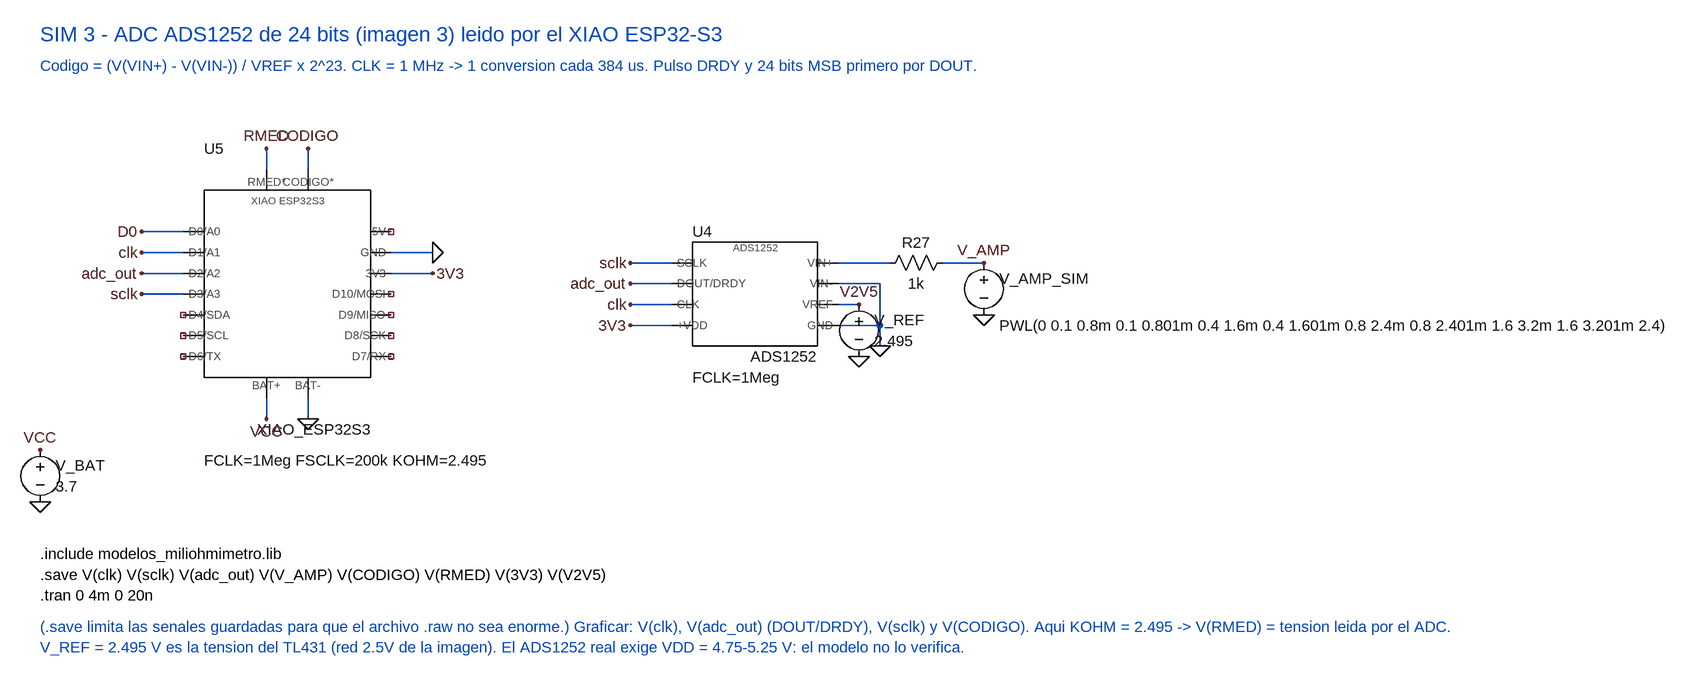
[diagram p0: schematic Sim3_ADS1252.asc]
Sim3_ADS1252.asc, the LTspice schematic file:
Version 4
SHEET 1 2400 1800
WIRE 128 -48 208 -48
WIRE 288 -48 352 -48
WIRE 128 -16 192 -16
WIRE 192 -16 192 48
WIRE 128 48 192 48
WIRE 192 48 192 80
WIRE 128 16 160 16
WIRE -128 -48 -192 -48
WIRE -128 -16 -192 -16
WIRE -128 16 -192 16
WIRE -128 48 -192 48
WIRE -880 -96 -944 -96
WIRE -880 -64 -944 -64
WIRE -880 -32 -944 -32
WIRE -880 0 -944 0
WIRE -560 -64 -496 -64
WIRE -560 -32 -496 -32
WIRE -752 160 -752 192
WIRE -688 160 -688 192
WIRE -752 -192 -752 -224
WIRE -688 -192 -688 -224
FLAG 352 -48 V_AMP
FLAG 192 80 0
FLAG 160 16 V2V5
FLAG -192 -48 sclk
FLAG -192 -16 adc_out
FLAG -192 16 clk
FLAG -192 48 3V3
FLAG 352 32 0
FLAG 160 96 0
FLAG -944 -96 D0
FLAG -944 -64 clk
FLAG -944 -32 adc_out
FLAG -944 0 sclk
FLAG -496 -64 0
FLAG -496 -32 3V3
FLAG -752 192 VCC
FLAG -688 192 0
FLAG -752 -224 RMED
FLAG -688 -224 CODIGO
FLAG -1100 240 VCC
FLAG -1100 320 0
SYMBOL ADS1252 0 0 R0
WINDOW 0 -96 -96 Left 2
WINDOW 3 96 96 Right 2
WINDOW 39 -96 128 Left 2
SYMATTR InstName U4
SYMATTR Value ADS1252
SYMATTR SpiceLine FCLK=1Meg
SYMBOL res 304 -64 R90
WINDOW 0 0 56 VBottom 2
WINDOW 3 32 56 VTop 2
SYMATTR InstName R27
SYMATTR Value 1k
SYMBOL voltage 352 -64 R0
WINDOW 0 24 40 Left 2
WINDOW 3 24 112 Left 2
SYMATTR InstName V_AMP_SIM
SYMATTR Value PWL(0 0.1 0.8m 0.1 0.801m 0.4 1.6m 0.4 1.601m 0.8 2.4m 0.8 2.401m 1.6 3.2m 1.6 3.201m 2.4)
SYMBOL voltage 160 0 R0
WINDOW 0 24 40 Left 2
WINDOW 3 24 72 Left 2
SYMATTR InstName V_REF
SYMATTR Value 2.495
SYMBOL XIAO_ESP32S3 -720 0 R0
WINDOW 0 -128 -224 Left 2
WINDOW 3 128 208 Right 2
WINDOW 39 -128 256 Left 2
SYMATTR InstName U5
SYMATTR Value XIAO_ESP32S3
SYMATTR SpiceLine FCLK=1Meg FSCLK=200k KOHM=2.495
SYMBOL voltage -1100 224 R0
WINDOW 0 24 40 Left 2
WINDOW 3 24 72 Left 2
SYMATTR InstName V_BAT
SYMATTR Value 3.7
TEXT -1100 -400 Left 3 ;SIM 3 - ADC ADS1252 de 24 bits (imagen 3) leido por el XIAO ESP32-S3
TEXT -1100 -352 Left 2 ;Codigo = (V(VIN+) - V(VIN-)) / VREF x 2^23. CLK = 1 MHz -> 1 conversion cada 384 us. Pulso DRDY y 24 bits MSB primero por DOUT.
TEXT -1100 400 Left 2 !.include modelos_miliohmimetro.lib
TEXT -1100 432 Left 2 !.save V(clk) V(sclk) V(adc_out) V(V_AMP) V(CODIGO) V(RMED) V(3V3) V(V2V5)
TEXT -1100 464 Left 2 !.tran 0 4m 0 20n
TEXT -1100 512 Left 2 ;(.save limita las senales guardadas para que el archivo .raw no sea enorme.) Graficar: V(clk), V(adc_out) (DOUT/DRDY), V(sclk) y V(CODIGO). Aqui KOHM = 2.495 -> V(RMED) = tension leida por el ADC.
TEXT -1100 544 Left 2 ;V_REF = 2.495 V es la tension del TL431 (red 2.5V de la imagen). El ADS1252 real exige VDD = 4.75-5.25 V: el modelo no lo verifica.

The netlist it stands for:
* Sim3_ADS1252.asc
XU4 N001 0 3V3 clk adc_out sclk 0 V2V5 ADS1252 FCLK=1Meg  ; pins VIN+ VIN- +VDD CLK DOUT/DRDY SCLK GND VREF
R27 V_AMP N001 1k
V_AMP_SIM V_AMP 0 PWL(0 0.1 0.8m 0.1 0.801m 0.4 1.6m 0.4 1.601m 0.8 2.4m 0.8 2.401m 1.6 3.2m 1.6 3.201m 2.4)
V_REF V2V5 0 2.495
XU5 D0 clk adc_out sclk NC_01 NC_02 NC_03 NC_04 NC_05 NC_06 NC_07 3V3 0 NC_08 VCC 0 RMED CODIGO XIAO_ESP32S3 FCLK=1Meg FSCLK=200k KOHM=2.495  ; pins D0/A0 D1/A1 D2/A2 D3/A3 D4/SDA D5/SCL D6/TX D7/RX D8/SCK D9/MISO D10/MOSI 3V3 GND 5V BAT+ BAT- RMED* CODIGO*
V_BAT VCC 0 3.7
* SIM 3 - ADC ADS1252 de 24 bits (imagen 3) leido por el XIAO ESP32-S3
* Codigo = (V(VIN+) - V(VIN-)) / VREF x 2^23. CLK = 1 MHz -> 1 conversion cada 384 us. Pulso DRDY y 24 bits MSB primero por DOUT.
.include modelos_miliohmimetro.lib
.save V(clk) V(sclk) V(adc_out) V(V_AMP) V(CODIGO) V(RMED) V(3V3) V(V2V5)
.tran 0 4m 0 20n
* (.save limita las senales guardadas para que el archivo .raw no sea enorme.) Graficar: V(clk), V(adc_out) (DOUT/DRDY), V(sclk) y V(CODIGO). Aqui KOHM = 2.495 -> V(RMED) = tension leida por el ADC.
* V_REF = 2.495 V es la tension del TL431 (red 2.5V de la imagen). El ADS1252 real exige VDD = 4.75-5.25 V: el modelo no lo verifica.
.backanno
.end